# Altium schematic sheet Battery Charger.SchDoc
size A4; SheetNumber: 6; SheetTotal: 7
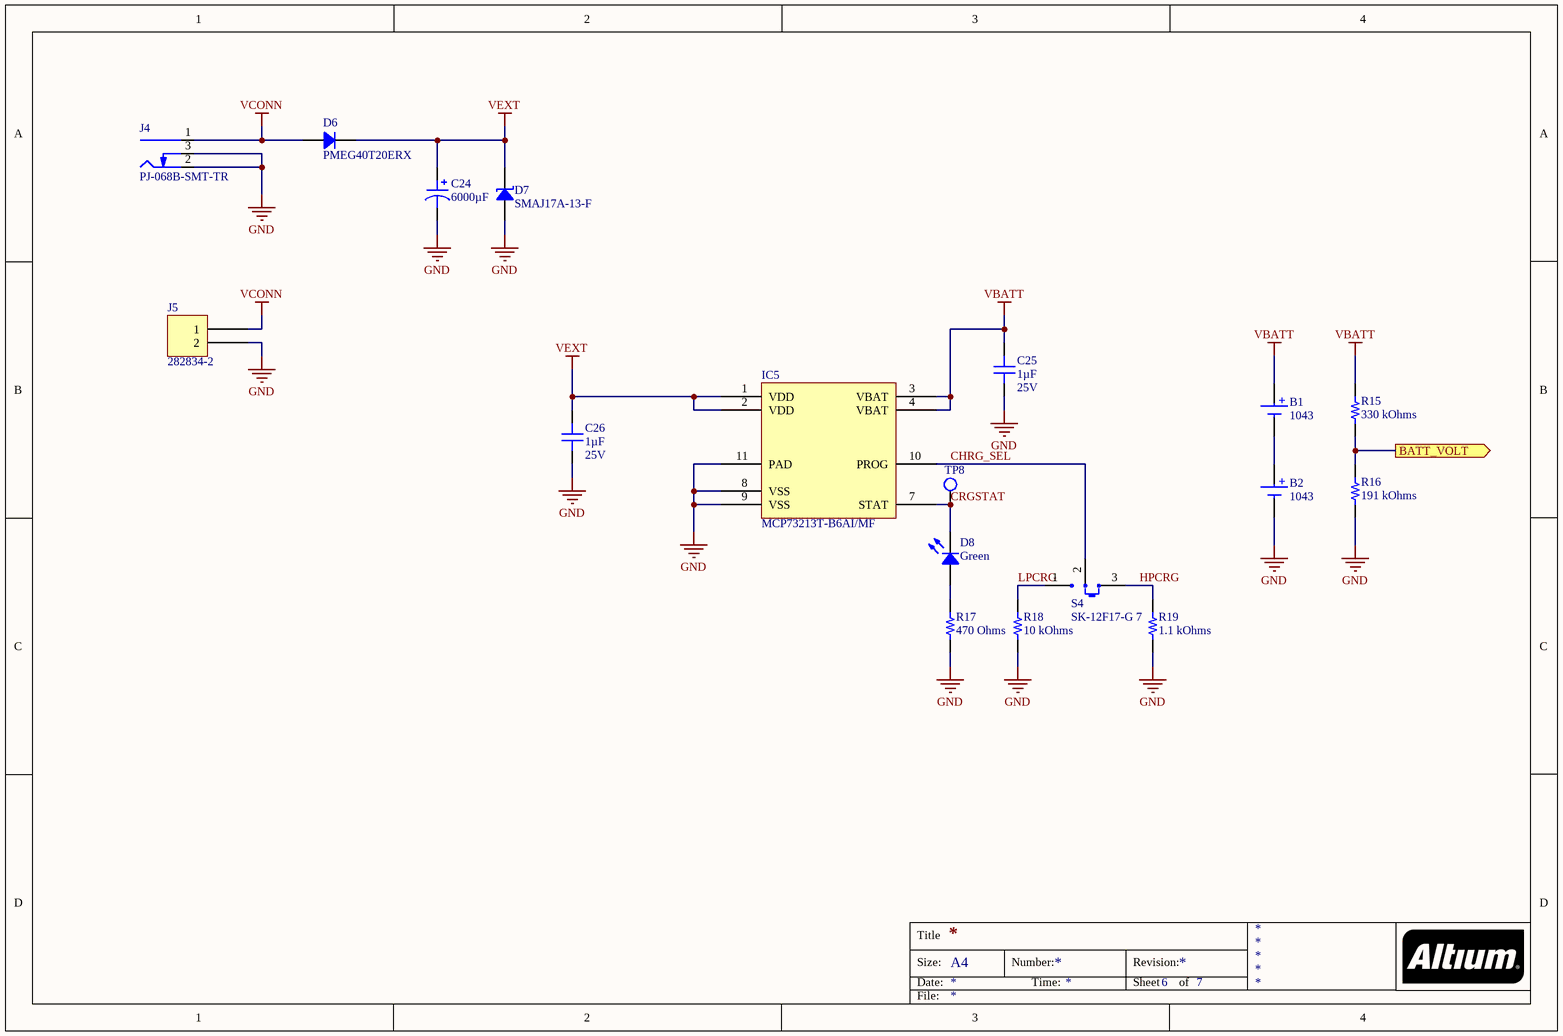
[diagram p0: Battery Charger.SchDoc]

## Parts
B1  1043  [KEYSTONE 1043]
B2  1043  [KEYSTONE 1043]
C24  6000µF  [CAP TH ALUM ELEC D18.00mm S7.50mm H33.00mm]
C25  Voltage - Rated: 25V  [CAP 0603_1608]  (hidden comment: 1µF)
C26  Voltage - Rated: 25V  [CAP 0603_1608]  (hidden comment: 1µF)
D6  PMEG40T20ERX  [SOD-123W]
D7  SMAJ17A-13-F  [DO214AC SMA]
D8  Green  [LED 1206_3216 GREEN]
IC5  MCP73213T-B6AI/MF  [MICROCHIP DFN-10 3MMX3MM MF]
J4  PJ-068B-SMT-TR  [CUI PJ-068B-SMT]
J5  282834-2  [TE 282834-2]
R15  330 kOhms  [RES 0603_1608]
R16  191 kOhms  [RES 0603_1608]
R17  470 Ohms  [RES 0603_1608]
R18  10 kOhms  [RES 0603_1608]
R19  1.1 kOhms  [RES 0603_1608]
S4  SK-12F17-G 7  [C&K SK-12F17-G 7]
TP8  Test Point  [TestPoint-1.5mm]  (value not drawn)  (no BOM)

## Ports
BATT_VOLT (out)

## Nets
GND: B2.2(-) C24.2 C25.2 C26.2 D7.1 IC5.8(VSS) IC5.9(VSS) IC5.11(PAD) J4.2(Outer) J4.3(SW) J5.2 R16.1 R17.1 R18.1 R19.1
VBATT: B1.1(+) C25.1 IC5.3(VBAT) IC5.4(VBAT) R15.2
VCONN: D6.1 J4.1(Centre) J5.1
VEXT: C24.1 C26.1 D6.2 D7.2 IC5.1(VDD) IC5.2(VDD)
BATT_VOLT: R15.1 R16.2 ; port BATT_VOLT
CHRG_SEL: IC5.10(PROG) S4.2(COM)
CRGSTAT: D8.2 IC5.7(STAT) TP8.1(TP)
HPCRG: R19.2 S4.3
LPCRG: R18.2 S4.1
NetB1_2: B1.2(-) B2.1(+)
NetD8_1: D8.1 R17.2

## Notes on the sheet
- Title
- Size:
- Date:
- A4
- Number:
- Time:
- Revision:
- Sheet
- of
- File:

## Library data of the parts
B1 B2 = 1043: BATTERY HOLDER 18650 PC PIN; Manufacturer: Keystone Electronics; Battery Cell Size: 18650; Battery Type, Function: Cylindrical, Holder; Number of Cells: 1; Style: Holder (Open); Part Number: 1043; ComponentLink1Description: Datasheet; ComponentLink1URL: http://keyelco.com/userAssets/file/M65p27.pdf; ComponentLink2Description: DigiKey Link; ComponentLink2URL: http://digikey.com/product-detail/en/keystone-electronics/1043/36-1043-ND/2745669; Height Above Board: 0.585" (14.86mm); LastUpdated: 02/02/2020 09:19:56; Lifecycle Status: Active; Minimum Order: 1; Mounting Type: PCB, Through Hole; Operating Temperature: -50°C ~ 145°C; Packaging: Unknown; PartId: 2; Part Status: Active; Price: 2.58; Series: -; Supplier 1: DigiKey; Supplier Part Number 1: 36-1043-ND; Termination Style: PC Pin
C24 = ELBK350ELL602AMN3S: CAP ALUM 6000UF 35V T/H; Manufacturer: United Chemi-Con; ESR (Equivalent Series Resistance): 19mOhm @ 100kHz; Lifetime @ Temp.: 5000 Hrs @ 105°C; Polarization: Polar; Ripple Current @ High Frequency: 3.5A @ 100kHz; Ripple Current @ Low Frequency: 2.975A @ 120Hz; Part Number: ELBK350ELL602AMN3S; Applications: Automotive; Capacitance: 6000µF; ComponentLink1Description: Datasheet; ComponentLink1URL: //media.digikey.com/pdf/Data%20Sheets/United%20Chemi-Con%20PDFs/LBK_Series.pdf; ComponentLink2Description: DigiKey Link; ComponentLink2URL: http://digikey.com/product-detail/en/united-chemi-con/ELBK350ELL602AMN3S/565-4353-ND/5824556; Device Package: Radial, Can; Height - Seated (Max): 1.299" (33.00mm); LastUpdated: 02/09/2020 01:33:24; Lead Spacing: 0.295" (7.50mm); Lifecycle Status: Active; Minimum Order: 1; Mounting Type: Through Hole; Operating Temperature: -55°C ~ 105°C; Package / Case: Radial, Can; Packaging: Bulk; PartId: 18495; Part Status: Active; Price: 3.93; Ratings: AEC-Q200; Series: LBK; Size / Dimension: 0.709" Dia (18.00mm); Supplier 1: DigiKey; Supplier Part Number 1: 565-4353-ND; Value: 6000µF; Voltage - Rated: 35V
C25 C26 = CL10A105KA8NNNC: CAP CER 1UF 25V X5R 0603; Manufacturer: Samsung Electro-Mechanics; Tolerance: ±10%; Part Number: CL10A105KA8NNNC; Value: 1µF; Applications: General Purpose; Capacitance: 1µF; ComponentLink1Description: Datasheet; ComponentLink1URL: http://www.samsungsem.com/kr/support/product-search/mlcc/CL10A105KA8NNNC.jsp; ComponentLink2Description: DigiKey Link; ComponentLink2URL: http://digikey.com/product-detail/en/samsung-electro-mechanics/CL10A105KA8NNNC/1276-1102-1-ND/3889188; Device Package: 0603 (1608 Metric); LastUpdated: 02/09/2020 01:03:30; Lifecycle Status: Active; Minimum Order: 1; Mounting Type: Surface Mount, MLCC; Operating Temperature: -55°C ~ 85°C; Package / Case: 0603 (1608 Metric); Packaging: TapeAndReel; PartId: 5508; Part Status: Active; Price: 0.01; Series: CL; Size / Dimension: 0.063" L x 0.031" W (1.60mm x 0.80mm); Supplier 1: DigiKey; Supplier Part Number 1: 1276-1102-1-ND; Temperature Coefficient: X5R; Thickness (Max): 0.035" (0.90mm)
D6 = PMEG40T20ERX: DIODE SCHOTTKY 40V 2A SOD123W; Manufacturer: Nexperia USA Inc.; Capacitance @ Vr, F: 350pF @ 1V, 1MHz; Current - Reverse Leakage @ Vr: 22µA @ 40V; Reverse Recovery Time (trr): 11.5ns; Speed: Fast Recovery =< 500ns, > 200mA (Io); Voltage - Forward (Vf) (Max) @ If: 450mV @ 2A; Part Number: PMEG40T20ERX; ComponentLink1Description: Datasheet; ComponentLink1URL: https://assets.nexperia.com/documents/data-sheet/PMEG40T20ER.pdf; ComponentLink2Description: DigiKey Link; ComponentLink2URL: http://digikey.com/product-detail/en/nexperia-usa-inc/PMEG40T20ERX/1727-7479-1-ND/7897325; Current - Average Rectified (Io): 2A; Diode Type: Schottky; LastUpdated: 02/09/2020 01:30:31; Lifecycle Status: Active; Minimum Order: 1; Mounting Type: Surface Mount; Operating Temperature - Junction: 175°C (Max); Package / Case: SOD-123W; Packaging: TapeAndReel; PartId: 3169; Part Status: Active; Price: 0.12; Series: Automotive, AEC-Q101; Supplier 1: DigiKey; Supplier Part Number 1: 1727-7479-1-ND; Supplier Device Package: SOD-123W; Voltage - DC Reverse (Vr) (Max): 40V
D7 = SMAJ17A-13-F: TVS DIODE 17V 27.6V SMA; Manufacturer: Diodes Incorporated; Current - Peak Pulse (10/1000µs): 14.5A; Power Line Protection: No; Power - Peak Pulse: 400W; Type: Zener; Unidirectional Channels: 1; Voltage - Breakdown (Min): 18.9V; Part Number: SMAJ17A-13-F; Applications: General Purpose; ComponentLink1Description: Datasheet; ComponentLink1URL: https://www.diodes.com/assets/Datasheets/ds19005.pdf; ComponentLink2Description: DigiKey Link; ComponentLink2URL: http://digikey.com/product-detail/en/diodes-incorporated/SMAJ17A-13-F/SMAJ17A-FDICT-ND/806582; LastUpdated: 02/09/2020 01:20:16; Lifecycle Status: Active; Minimum Order: 1; Mounting Type: Surface Mount; Operating Temperature: -55°C ~ 150°C (TJ); Package / Case: DO-214AC, SMA; Packaging: TapeAndReel; PartId: 5955; Part Status: Active; Price: 0.08; Series: -; Supplier 1: DigiKey; Supplier Part Number 1: SMAJ17A-FDICT-ND; Supplier Device Package: SMA; Voltage - Clamping (Max) @ Ipp: 27.6V; Voltage - Reverse Standoff (Typ): 17V
D8 = QTLP650C4TR: LED GREEN CLEAR 1206 SMD; Manufacturer: Everlight Electronics Co Ltd; Configuration: Standard; Current - Test: 20mA; Lens Color: Colorless; Lens Size: 2.00mm x 1.60mm; Lens Style: Rectangle with Flat Top; Millicandela Rating: 10mcd; Viewing Angle: 140°; Voltage - Forward (Vf) (Typ): 2.1V; Wavelength - Dominant: 570nm; Wavelength - Peak: 565nm; Part Number: QTLP650C4TR; Color: Green; ComponentLink1Description: Datasheet; ComponentLink1URL: //media.digikey.com/pdf/Data%20Sheets/Everlight%20PDFs/QTLP650(C,D)-2,3,4,7,B.pdf; ComponentLink2Description: DigiKey Link; ComponentLink2URL: http://digikey.com/product-detail/en/everlight-electronics-co-ltd/QTLP650C4TR/1080-1415-1-ND/2676149; Device Package: 1206 (3216 Metric); Height (Max): 1.30mm; LastUpdated: 02/09/2020 01:20:47; Lens Transparency: Clear; Lifecycle Status: Active; Minimum Order: 1; Mounting Type: Surface Mount; Package / Case: 1206 (3216 Metric); Packaging: TapeAndReel; PartId: 563; Part Status: Active; Price: 0.06; Series: -; Size / Dimension: 3.20mm L x 1.60mm W; Supplier 1: DigiKey; Supplier Part Number 1: 1080-1415-1-ND; Supplier Device Package: 1206; Value: Green
IC5 = MCP73213T-B6AI/MF: DUAL CELL OVP BATTERY CHARGER; Manufacturer: Microchip Technology; Battery Chemistry: Lithium Ion/Polymer; Battery Pack Voltage: 8.2V; Charge Current - Max: 1.1A; Current - Charging: Constant - Programmable; Fault Protection: Over Voltage; Number of Cells: 2; Voltage - Supply (Max): 13V; Part Number: MCP73213T-B6AI/MF; ComponentLink1Description: Datasheet; ComponentLink1URL: http://www.microchip.com/mymicrochip/filehandler.aspx?ddocname=en544011; ComponentLink2Description: DigiKey Link; ComponentLink2URL: http://digikey.com/product-detail/en/microchip-technology/MCP73213T-B6AI-MF/MCP73213T-B6AI-MFCT-ND/7898471; LastUpdated: 18/01/2022 15:56:16; Lifecycle Status: Active; Minimum Order: 1; Mounting Type: Surface Mount; Operating Temperature: -40°C ~ 85°C (TA); Package / Case: 10-VFDFN Exposed Pad; Packaging: TapeAndReel; PartId: 43; Part Status: Active; Price: 1.35; Series: -; Supplier 1: DigiKey; Supplier Part Number 1: MCP73213T-B6AI/MFCT-ND; Supplier Device Package: 10-DFN (3x3)
J4 = PJ-068B-SMT-TR: CONN PWR JACK 2.5X5.5MM SOLDER; Manufacturer: CUI Devices; Actual Diameter: 0.098" (2.50mm ID), 0.232" (5.90mm OD); Current Rating (Amps): 5A; Gender: Male; Industry Recognized Mating Diameter: 2.50mm ID (0.098"), 5.50mm OD (0.217"); Internal Switch(s): Single Switch, Normally Closed; Material Flammability Rating: UL94 V-0; Mating Length/Depth: 0.323" (8.20mm); Number of Positions/Contacts: 2 Conductors, 3 Contacts; Shielding: Shielded; Voltage - Rated: 24VDC; Part Number: PJ-068B-SMT-TR; ComponentLink1Description: Datasheet; ComponentLink1URL: https://www.cuidevices.com/product/resource/digikeypdf/pj-068b-smt-tr.pdf; ComponentLink2Description: DigiKey Link; ComponentLink2URL: //digikey.com/product-detail/en/cui-devices/PJ-068B-SMT-TR/CP-068BPJTR-ND/2625163; Connector Type: Jack; Features: Board Guide; LastUpdated: 16/12/2019 18:57:10; Lifecycle Status: 0; Minimum Order: 1; Mounting Type: Surface Mount, Right Angle; Packaging: TapeAndReel; Part Status: Active; Price: 1.38; Series: -; Supplier 1: DigiKey; Supplier Part Number 1: CP-068BPJTR-ND; Termination: Solder
J5 = 282834-2: TERM BLK 2P SIDE ENT 2.54MM PCB; Manufacturer: TE Connectivity AMP Connectors; Current: 10A; Mating Orientation: Horizontal with Board; Number of Levels: 1; Pitch: 0.100" (2.54mm); Positions Per Level: 2; Voltage: 150V; Wire Gauge: 16-30 AWG; Wire Termination: Screw - Rising Cage Clamp; Part Number: 282834-2; Color: Green; ComponentLink1Description: Datasheet; ComponentLink1URL: https://www.te.com/commerce/DocumentDelivery/DDEController?Action=srchrtrv&DocNm=282834&DocType=Customer+Drawing&DocLang=English; ComponentLink2Description: DigiKey Link; ComponentLink2URL: http://digikey.com/product-detail/en/te-connectivity-amp-connectors/282834-2/A98333-ND/1150135; LastUpdated: 15/01/2020 04:15:38; Lifecycle Status: Active; Minimum Order: 1; Mounting Type: Through Hole; Packaging: Bulk; Part Status: Active; Price: 0.88; Series: Buchanan; Supplier 1: DigiKey; Supplier Part Number 1: A98333-ND
R15 = ERJ-PA3J334V: RES SMD 330K OHM 5% 1/4W 0603; Manufacturer: Panasonic Electronic Components; Power (Watts): 0.25W, 1/4W; Temperature Coefficient: ±200ppm/°C; Part Number: ERJ-PA3J334V; Value: 330 kOhms; ComponentLink1Description: Datasheet; ComponentLink1URL: https://industrial.panasonic.com/cdbs/www-data/pdf/RDO0000/AOA0000C331.pdf; ComponentLink2Description: DigiKey Link; ComponentLink2URL: http://digikey.com/product-detail/en/panasonic-electronic-components/ERJ-PA3J334V/P330KBZCT-ND/5036310; Composition: Thick Film; Device Package: 0603 (1608 Metric); Features: Automotive AEC-Q200, Pulse Withstanding; Height - Seated (Max): 0.022" (0.55mm); LastUpdated: 02/09/2020 01:10:16; Lifecycle Status: Active; Minimum Order: 1; Number of Terminations: 2; Operating Temperature: -55°C ~ 155°C; Package / Case: 0603 (1608 Metric); Packaging: TapeAndReel; PartId: 8919; Part Status: Active; Price: 0.01; Ratings: AEC-Q200; Resistance: 330 kOhms; Series: ERJ; Size / Dimension: 0.063" L x 0.031" W (1.60mm x 0.80mm); Supplier 1: DigiKey; Supplier Part Number 1: P330KBZCT-ND; Supplier Device Package: 0603; Tolerance: ±5%
R16 = ERJ-3EKF1913V: RES SMD 191K OHM 1% 1/10W 0603; Manufacturer: Panasonic Electronic Components; Power (Watts): 0.1W, 1/10W; Temperature Coefficient: ±100ppm/°C; Part Number: ERJ-3EKF1913V; Value: 191 kOhms; ComponentLink1Description: Datasheet; ComponentLink1URL: https://industrial.panasonic.com/cdbs/www-data/pdf/RDA0000/AOA0000C304.pdf; ComponentLink2Description: DigiKey Link; ComponentLink2URL: http://digikey.com/product-detail/en/panasonic-electronic-components/ERJ-3EKF1913V/P191KHCT-ND/198216; Composition: Thick Film; Device Package: 0603 (1608 Metric); Features: Automotive AEC-Q200; Height - Seated (Max): 0.022" (0.55mm); LastUpdated: 02/09/2020 01:09:38; Lifecycle Status: Active; Minimum Order: 1; Number of Terminations: 2; Operating Temperature: -55°C ~ 155°C; Package / Case: 0603 (1608 Metric); Packaging: TapeAndReel; PartId: 24201; Part Status: Active; Price: 0.01; Ratings: AEC-Q200; Resistance: 191 kOhms; Series: ERJ; Size / Dimension: 0.063" L x 0.031" W (1.60mm x 0.80mm); Supplier 1: DigiKey; Supplier Part Number 1: P191KHCT-ND; Supplier Device Package: 0603; Tolerance: ±1%
R17 = CRGCQ0603J470R: CRGCQ 0603 470R 5%; Manufacturer: TE Connectivity Passive Product; Power (Watts): 0.1W, 1/10W; Temperature Coefficient: ±100ppm/°C; Part Number: CRGCQ0603J470R; Value: 470 Ohms; ComponentLink1Description: Datasheet; ComponentLink1URL: https://www.te.com/commerce/DocumentDelivery/DDEController?Action=srchrtrv&DocNm=1773204-3&DocType=DS&DocLang=English; ComponentLink2Description: DigiKey Link; ComponentLink2URL: http://digikey.com/product-detail/en/te-connectivity-passive-product/CRGCQ0603J470R/A130089CT-ND/8577921; Composition: Thick Film; Device Package: 0603 (1608 Metric); Features: Automotive AEC-Q200, Moisture Resistant; Height - Seated (Max): 0.022" (0.55mm); LastUpdated: 02/09/2020 01:09:31; Lifecycle Status: Active; Minimum Order: 1; Number of Terminations: 2; Operating Temperature: -55°C ~ 155°C; Package / Case: 0603 (1608 Metric); Packaging: CutTape; PartId: 25681; Part Status: Active; Price: 0.10; Ratings: AEC-Q200; Resistance: 470 Ohms; Series: CRGCQ; Size / Dimension: 0.063" L x 0.031" W (1.60mm x 0.80mm); Supplier 1: DigiKey; Supplier Part Number 1: A130089CT-ND; Supplier Device Package: 0603; Tolerance: ±5%
R18 = ERJ-PA3J103V: RES SMD 10K OHM 5% 1/4W 0603; Manufacturer: Panasonic Electronic Components; Power (Watts): 0.25W, 1/4W; Temperature Coefficient: ±200ppm/°C; Part Number: ERJ-PA3J103V; Value: 10 kOhms; ComponentLink1Description: Datasheet; ComponentLink1URL: https://industrial.panasonic.com/cdbs/www-data/pdf/RDO0000/AOA0000C331.pdf; ComponentLink2Description: DigiKey Link; ComponentLink2URL: http://digikey.com/product-detail/en/panasonic-electronic-components/ERJ-PA3J103V/P10KBZCT-ND/5036237; Composition: Thick Film; Device Package: 0603 (1608 Metric); Features: Automotive AEC-Q200, Pulse Withstanding; Height - Seated (Max): 0.022" (0.55mm); LastUpdated: 02/09/2020 01:10:16; Lifecycle Status: Active; Minimum Order: 1; Number of Terminations: 2; Operating Temperature: -55°C ~ 155°C; Package / Case: 0603 (1608 Metric); Packaging: TapeAndReel; PartId: 8965; Part Status: Active; Price: 0.01; Ratings: AEC-Q200; Resistance: 10 kOhms; Series: ERJ; Size / Dimension: 0.063" L x 0.031" W (1.60mm x 0.80mm); Supplier 1: DigiKey; Supplier Part Number 1: P10KBZCT-ND; Supplier Device Package: 0603; Tolerance: ±5%
R19 = ERJ-3EKF1101V: RES SMD 1.1K OHM 1% 1/10W 0603; Manufacturer: Panasonic Electronic Components; Power (Watts): 0.1W, 1/10W; Temperature Coefficient: ±100ppm/°C; Part Number: ERJ-3EKF1101V; Value: 1.1 kOhms; ComponentLink1Description: Datasheet; ComponentLink1URL: https://industrial.panasonic.com/cdbs/www-data/pdf/RDA0000/AOA0000C304.pdf; ComponentLink2Description: DigiKey Link; ComponentLink2URL: http://digikey.com/product-detail/en/panasonic-electronic-components/ERJ-3EKF1101V/P1.10KHCT-ND/198075; Composition: Thick Film; Device Package: 0603 (1608 Metric); Features: Automotive AEC-Q200; Height - Seated (Max): 0.022" (0.55mm); LastUpdated: 02/09/2020 01:09:43; Lifecycle Status: Active; Minimum Order: 1; Number of Terminations: 2; Operating Temperature: -55°C ~ 155°C; Package / Case: 0603 (1608 Metric); Packaging: TapeAndReel; PartId: 23085; Part Status: Active; Price: 0.01; Ratings: AEC-Q200; Resistance: 1.1 kOhms; Series: ERJ; Size / Dimension: 0.063" L x 0.031" W (1.60mm x 0.80mm); Supplier 1: DigiKey; Supplier Part Number 1: P1.10KHCT-ND; Supplier Device Package: 0603; Tolerance: ±1%
S4 = SK-12F17-G 7: SWITCH SLIDE SPDT 300MA 30V; Manufacturer: C&K; Actuator Length: 7.00mm; Actuator Type: Standard; Contact Timing: Not Specified; Current Rating (Amps): 300mA (DC); Switch Function: On-On; Part Number: SK-12F17-G 7; Circuit: SPDT; ComponentLink1Description: Datasheet; ComponentLink1URL: //media.digikey.com/pdf/Data%20Sheets/C&K/SK-12F17-G.pdf; ComponentLink2Description: DigiKey Link; ComponentLink2URL: http://digikey.com/product-detail/en/c-k/SK-12F17-G-7/CKN10393-ND/2747163; Contact Finish: Silver; Contact Material: Copper; LastUpdated: 22/01/2022 09:16:27; Lifecycle Status: Active; Minimum Order: 1; Mounting Type: Through Hole, Right Angle; Packaging: Bulk; PartId: 3; Part Status: Active; Price: 0.55; Series: SK, COMAX; Supplier 1: DigiKey; Supplier Part Number 1: CKN10393-ND; Termination Style: PC Pin; Voltage Rating - DC: 30V